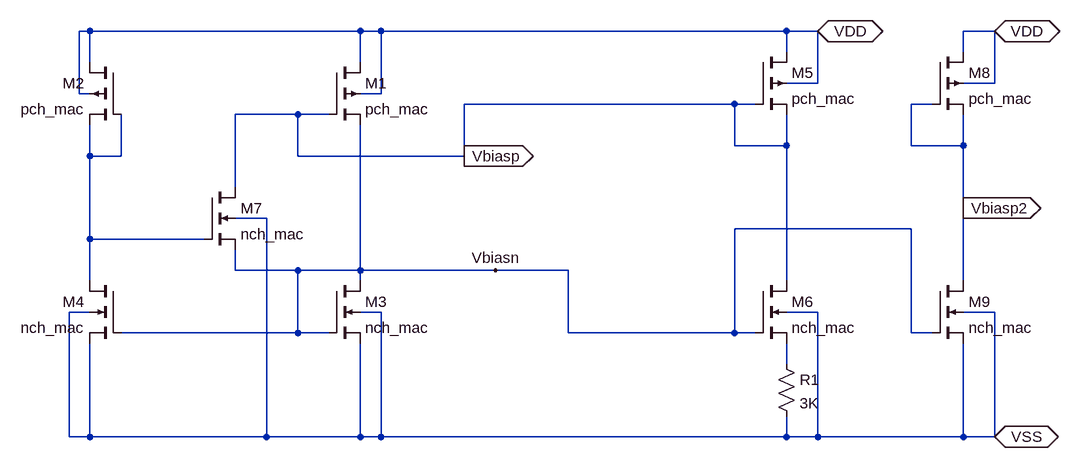
[diagram p0: schematic BiasCircuit.asc]
BiasCircuit.asc, the LTspice schematic file:
Version 4
SHEET 1 1112 680
WIRE -416 -208 -432 -208
WIRE 0 -208 -416 -208
WIRE 32 -208 0 -208
WIRE 656 -208 32 -208
WIRE 704 -208 656 -208
WIRE 976 -208 928 -208
WIRE 656 -176 656 -208
WIRE 928 -176 928 -208
WIRE -416 -160 -416 -208
WIRE 0 -160 0 -208
WIRE 704 -128 704 -208
WIRE 704 -128 656 -128
WIRE 976 -128 976 -208
WIRE 976 -128 928 -128
WIRE -432 -112 -432 -208
WIRE -416 -112 -432 -112
WIRE 32 -112 32 -208
WIRE 32 -112 0 -112
WIRE 576 -96 160 -96
WIRE 608 -96 576 -96
WIRE 880 -96 848 -96
WIRE -96 -80 -192 -80
WIRE -48 -80 -96 -80
WIRE 576 -32 576 -96
WIRE 656 -32 656 -80
WIRE 656 -32 576 -32
WIRE 848 -32 848 -96
WIRE 928 -32 928 -80
WIRE 928 -32 848 -32
WIRE -416 -16 -416 -64
WIRE -368 -16 -368 -80
WIRE -368 -16 -416 -16
WIRE -96 -16 -96 -80
WIRE 160 -16 160 -96
WIRE 160 -16 -96 -16
WIRE -192 32 -192 -80
WIRE 928 64 928 -32
WIRE -144 80 -192 80
WIRE 848 96 576 96
WIRE -416 112 -416 -16
WIRE -240 112 -416 112
WIRE -192 160 -192 128
WIRE -96 160 -192 160
WIRE 0 160 0 -64
WIRE 0 160 -96 160
WIRE 208 160 0 160
WIRE 320 160 208 160
WIRE -416 176 -416 112
WIRE 0 176 0 160
WIRE 656 176 656 -32
WIRE 928 176 928 64
WIRE -416 224 -448 224
WIRE 32 224 0 224
WIRE 704 224 656 224
WIRE 976 224 928 224
WIRE -96 256 -96 160
WIRE -96 256 -368 256
WIRE -48 256 -96 256
WIRE 320 256 320 160
WIRE 576 256 576 96
WIRE 576 256 320 256
WIRE 608 256 576 256
WIRE 848 256 848 96
WIRE 880 256 848 256
WIRE 656 304 656 272
WIRE -448 416 -448 224
WIRE -416 416 -416 272
WIRE -416 416 -448 416
WIRE -144 416 -144 80
WIRE -144 416 -416 416
WIRE 0 416 0 272
WIRE 0 416 -144 416
WIRE 32 416 32 224
WIRE 32 416 0 416
WIRE 656 416 656 384
WIRE 656 416 32 416
WIRE 704 416 704 224
WIRE 704 416 656 416
WIRE 928 416 928 272
WIRE 928 416 704 416
WIRE 976 416 976 224
WIRE 976 416 928 416
FLAG 160 -16 Vbiasp
IOPIN 160 -16 Out
FLAG 704 -208 VDD
IOPIN 704 -208 BiDir
FLAG 976 416 VSS
IOPIN 976 416 BiDir
FLAG 976 -208 VDD
IOPIN 976 -208 BiDir
FLAG 928 64 Vbiasp2
IOPIN 928 64 Out
FLAG 208 160 Vbiasn
SYMBOL pmos4 -48 -160 R0
SYMATTR InstName M1
SYMATTR Value pch_mac
SYMATTR Value2 l=2u w=30u
SYMBOL pmos4 -368 -160 M0
SYMATTR InstName M2
SYMATTR Value pch_mac
SYMATTR Value2 l=10u w=100u
SYMBOL nmos4 -48 176 R0
SYMATTR InstName M3
SYMATTR Value nch_mac
SYMATTR Value2 l=2u w=10u
SYMBOL nmos4 -368 176 M0
SYMATTR InstName M4
SYMATTR Value nch_mac
SYMATTR Value2 l=2u w=10u
SYMBOL pmos4 608 -176 R0
SYMATTR InstName M5
SYMATTR Value pch_mac
SYMATTR Value2 l=2u w=30u
SYMBOL nmos4 608 176 R0
SYMATTR InstName M6
SYMATTR Value nch_mac
SYMATTR Value2 l=2u w=40u
SYMBOL nmos4 -240 32 R0
SYMATTR InstName M7
SYMATTR Value nch_mac
SYMATTR Value2 l=10u w=10u
SYMBOL res 640 288 R0
SYMATTR InstName R1
SYMATTR Value 3K
SYMBOL pmos4 880 -176 R0
SYMATTR InstName M8
SYMATTR Value pch_mac
SYMATTR Value2 l=2u w=30u
SYMBOL nmos4 880 176 R0
SYMATTR InstName M9
SYMATTR Value nch_mac
SYMATTR Value2 l=3u w=2u

The netlist it stands for:
* BiasCircuit.asc
M1 VDD Vbiasp Vbiasn VDD pch_mac l=2u w=30u
M2 VDD N001 N001 VDD pch_mac l=10u w=100u
M3 Vbiasn Vbiasn VSS VSS nch_mac l=2u w=10u
M4 N001 Vbiasn VSS VSS nch_mac l=2u w=10u
M5 VDD Vbiasp Vbiasp VDD pch_mac l=2u w=30u
M6 Vbiasp Vbiasn N002 VSS nch_mac l=2u w=40u
M7 Vbiasp N001 Vbiasn VSS nch_mac l=10u w=10u
R1 N002 VSS 3K
M8 VDD Vbiasp2 Vbiasp2 VDD pch_mac l=2u w=30u
M9 Vbiasp2 Vbiasn VSS VSS nch_mac l=3u w=2u
.model NMOS NMOS
.model PMOS PMOS
.lib standard.mos
.backanno
.end